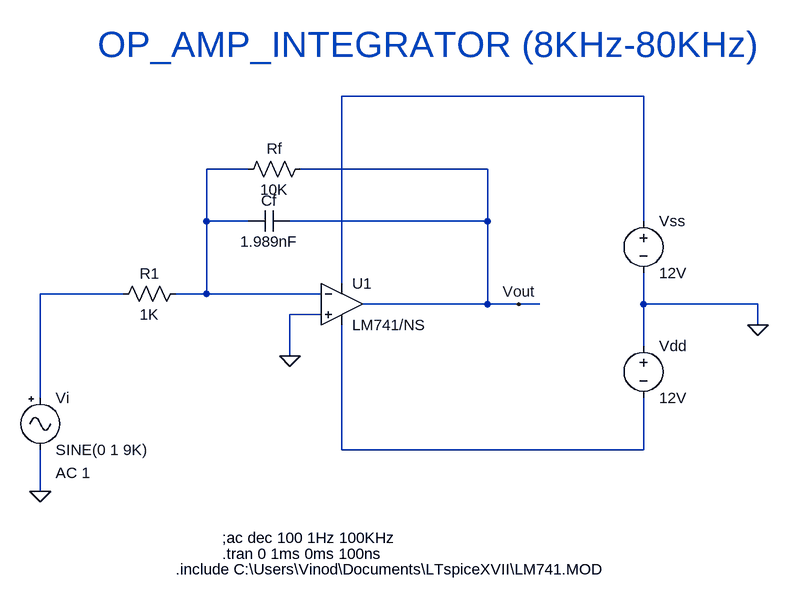
[diagram p0: schematic Integrator.asc]
Integrator.asc, the LTspice schematic file:
Version 4
SHEET 1 980 680
WIRE 784 -288 320 -288
WIRE 176 -176 112 -176
WIRE 544 -176 256 -176
WIRE 112 -96 112 -176
WIRE 176 -96 112 -96
WIRE 544 -96 544 -176
WIRE 544 -96 240 -96
WIRE 784 -96 784 -288
WIRE 320 0 320 -288
WIRE -16 16 -144 16
WIRE 112 16 112 -96
WIRE 112 16 64 16
WIRE 288 16 112 16
WIRE 544 32 544 -96
WIRE 544 32 352 32
WIRE 592 32 544 32
WIRE 624 32 592 32
WIRE 784 32 784 -16
WIRE 960 32 784 32
WIRE 288 48 240 48
WIRE 960 64 960 32
WIRE 784 96 784 32
WIRE 240 112 240 48
WIRE -144 176 -144 16
WIRE 320 256 320 64
WIRE 784 256 784 176
WIRE 784 256 320 256
WIRE -144 320 -144 256
FLAG -144 320 0
FLAG 240 112 0
FLAG 960 64 0
FLAG 592 32 Vout
SYMBOL OpAmps\\opamp2 320 -32 R0
SYMATTR InstName U1
SYMATTR Value LM741/NS
SYMBOL res 80 0 R90
WINDOW 0 0 56 VBottom 2
WINDOW 3 32 56 VTop 2
SYMATTR InstName R1
SYMATTR Value 1K
SYMBOL res 272 -192 R90
WINDOW 0 0 56 VBottom 2
WINDOW 3 32 56 VTop 2
SYMATTR InstName Rf
SYMATTR Value 10K
SYMBOL cap 240 -112 R90
WINDOW 0 0 32 VBottom 2
WINDOW 3 32 32 VTop 2
SYMATTR InstName Cf
SYMATTR Value 1.989nF
SYMBOL Misc\\signal -144 160 R0
WINDOW 123 24 132 Left 2
WINDOW 39 0 0 Left 0
SYMATTR Value2 AC 1
SYMATTR InstName Vi
SYMATTR Value SINE(0 1 9K)
SYMBOL voltage 784 -112 R0
SYMATTR InstName Vss
SYMATTR Value 12V
SYMBOL voltage 784 80 R0
SYMATTR InstName Vdd
SYMATTR Value 12V
TEXT 64 440 Left 2 !.include C:\\Users\\Vinod\\Documents\\LTspiceXVII\\LM741.MOD
TEXT 136 416 Left 2 !.tran 0 1ms 0ms 100ns
TEXT 136 392 Left 2 !;ac dec 100 1Hz 100KHz
TEXT -56 -368 Left 5 ;OP_AMP_INTEGRATOR (8KHz-80KHz)

The netlist it stands for:
* Integrator.asc
XU1 0 N002 N001 N004 Vout LM741/NS  ; pins In+ In- V+ V- OUT
R1 N002 N003 1K
Rf Vout N002 10K
Cf Vout N002 1.989nF
Vi N003 0 SINE(0 1 9K) AC 1
Vss N001 0 12V
Vdd 0 N004 12V
.include C:\Users\Vinod\Documents\LTspiceXVII\LM741.MOD
.tran 0 1ms 0ms 100ns
;ac dec 100 1Hz 100KHz
* OP_AMP_INTEGRATOR (8KHz-80KHz)
.backanno
.end